# EAGLE design adaptador_mcp3002_fpga (EAGLE 7.7.0)
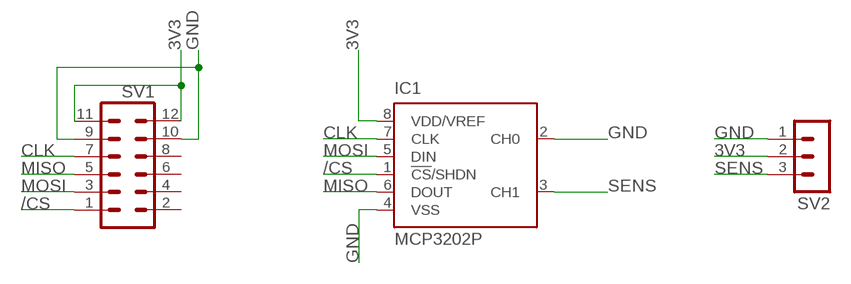
[diagram p0: schematic, sheet 1]

## Parts
IC1  MCP3202P  [DIL8]
SV1  MA06-2  [MA06-2]
SV2  MA03-1  [MA03-1]

## Nets
3V3: IC1.8(VDD/VREF) SV1.11 SV1.12 SV2.2
/CS: IC1.1(!CS!/SHDN) SV1.1
CLK: IC1.7(CLK) SV1.7
GND: IC1.2(CH0) IC1.4(VSS) SV1.9 SV1.10 SV2.1
MISO: IC1.6(DOUT) SV1.5
MOSI: IC1.5(DIN) SV1.3
SENS: IC1.3(CH1) SV2.3
Unconnected: SV1.2 SV1.4 SV1.6 SV1.8

## Library data of the parts
IC1 = microchip:MCP3202: 2.7V Dual Channel 12-Bit A/D Converter with SPI Serial Interface Source: http://ww1.microchip.com/downloads/en/DeviceDoc/21034D.pdf; MF: MICROCHIP; MPN: MCP3202-CI/P; OC_FARNELL: 1196794; OC_NEWARK: 72K7287
SV1 = con-lstb:MA06-2: PIN HEADER; OC_FARNELL: unknown; OC_NEWARK: unknown
SV2 = con-lstb:MA03-1: PIN HEADER; OC_FARNELL: unknown; OC_NEWARK: unknown

## Board
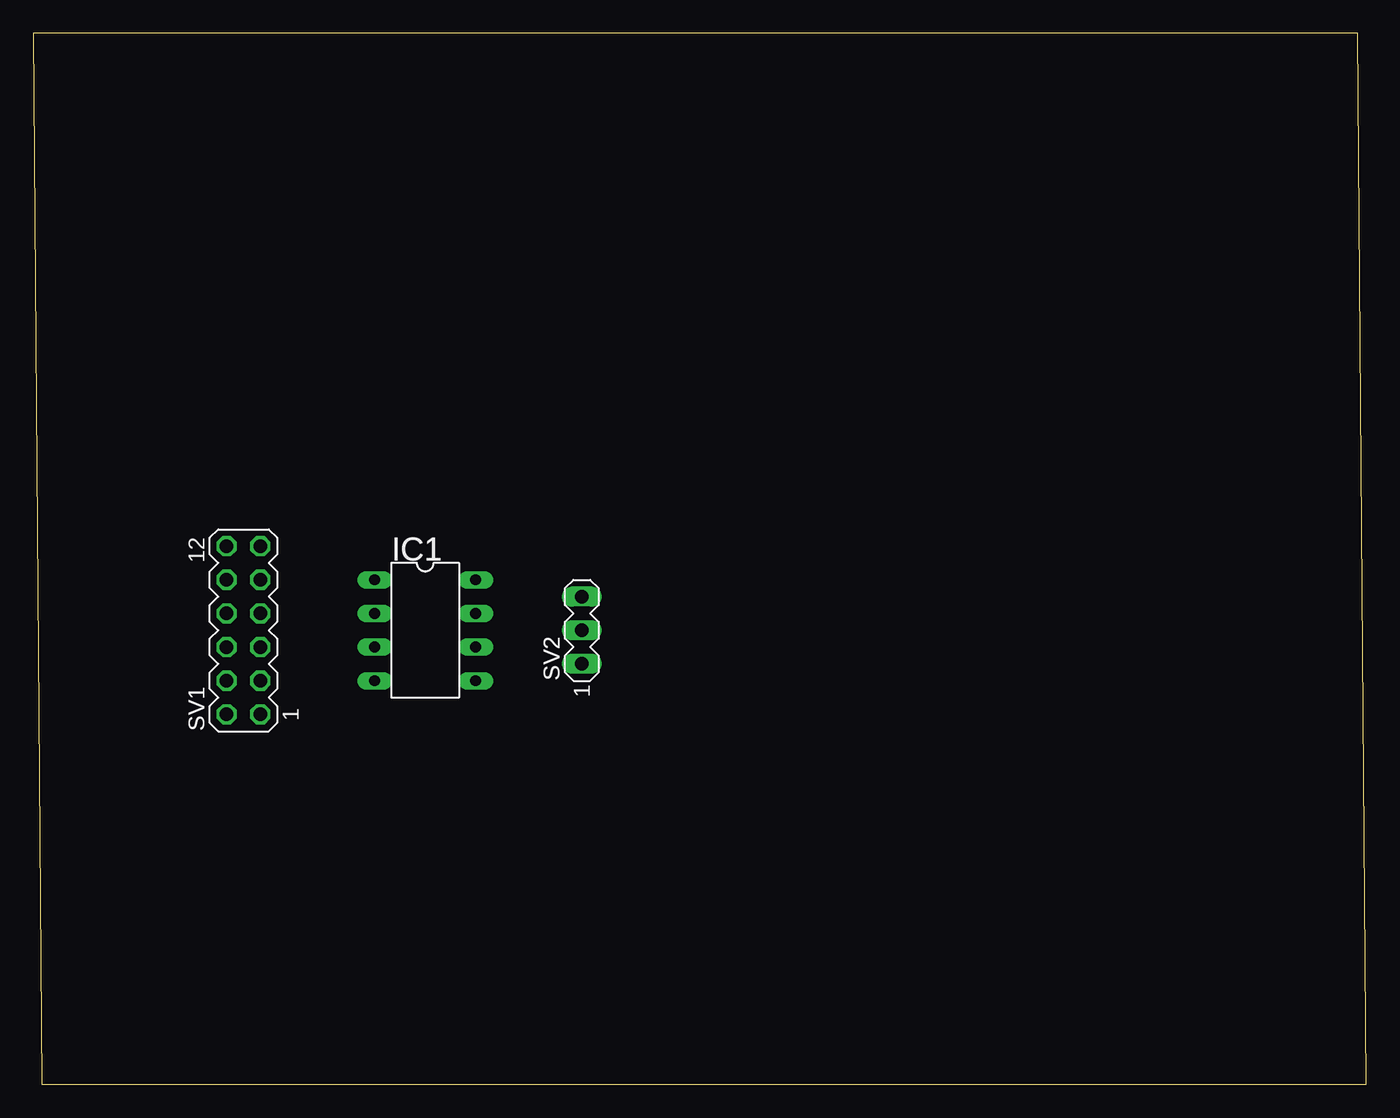
[diagram p1: board, top side]
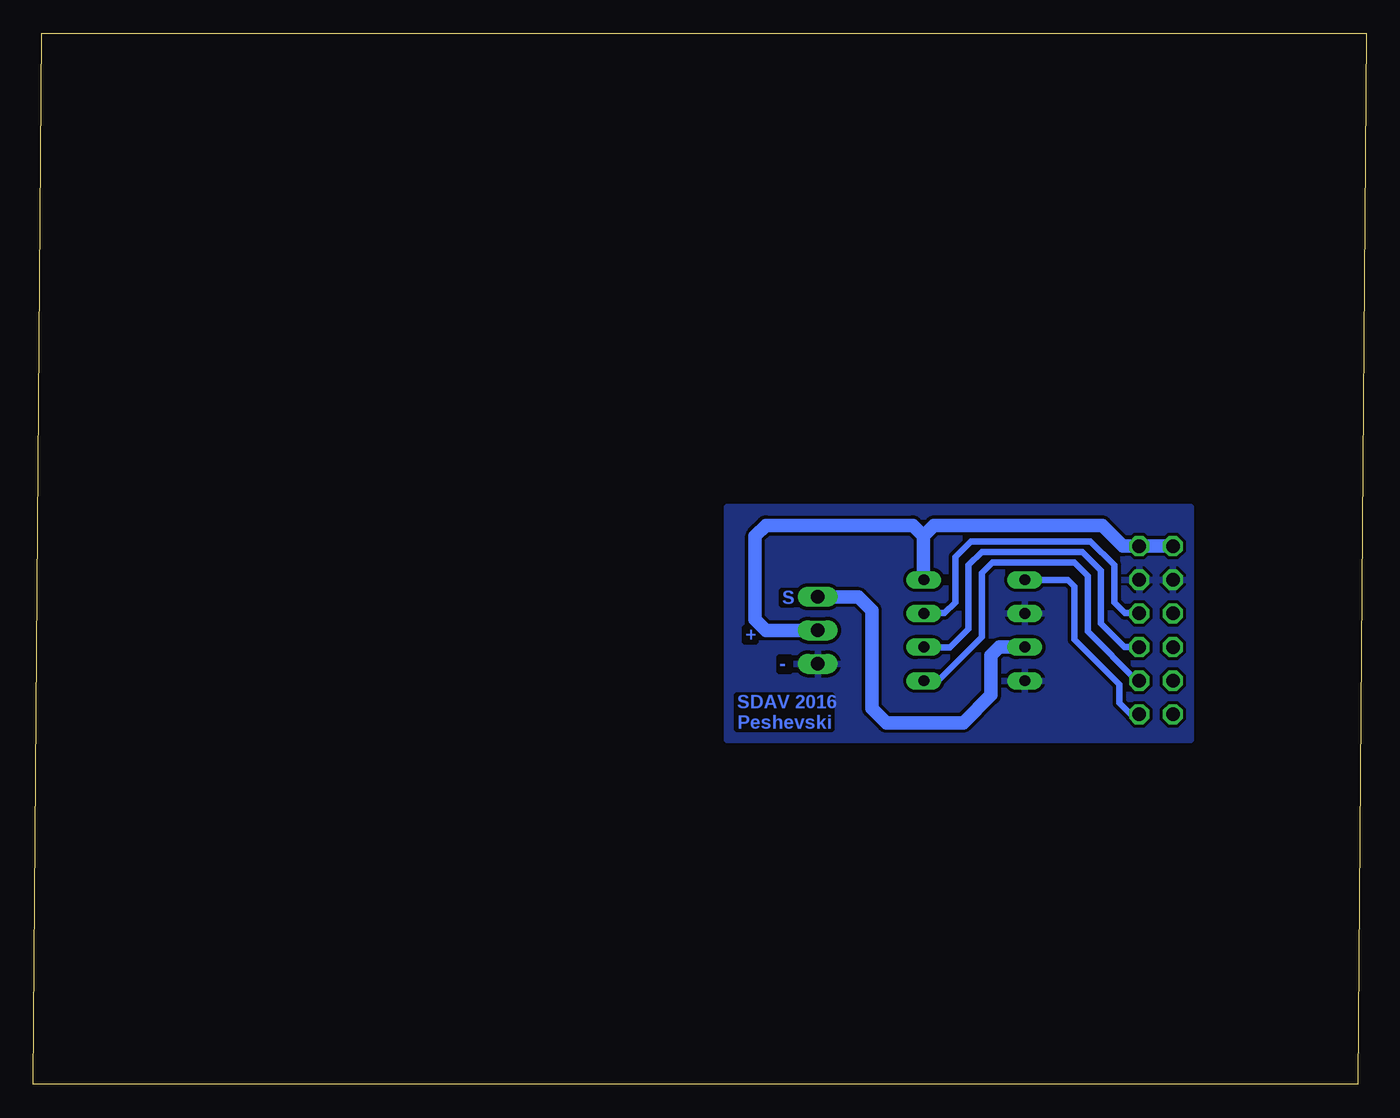
[diagram p2: board, bottom side, seen from below]

Size 100.64 x 79.36 mm. Coordinates in mm from the lower left corner, seen from the top.
Outline: 0.64,0 100.64,0 100,79.36 0,79.36 0.64,0
Copper layers (1*16): Top 0.035mm / dielectric 1.5mm / Bottom 0mil
Design rules "default *": minimum track width 10mil, minimum drill 24mil, track to track 8mil, track to pad 8mil, pad to pad 8mil, via to via 8mil, smd to smd 8mil, copper to edge 40mil, drill to drill 8mil, minimum pad ring 10mil, minimum via ring 8mil, stop-mask expansion 4mil, vias tented up to drill 0mil, thermal gap 10mil

### Footprints (pad centres in the part's own frame; a part is rotated, then mirrored left to right if it is on the bottom)
DIL8 = drill 0.813 long: 1 -3.81,-3.81; 2 -1.27,-3.81; 3 1.27,-3.81; 4 3.81,-3.81; 5 3.81,3.81; 6 1.27,3.81; 7 -1.27,3.81; 8 -3.81,3.81
MA06-2 = drill 1.016 octagon: 1 -6.35,-1.27; 2 -6.35,1.27; 3 -3.81,-1.27; 4 -3.81,1.27; 5 -1.27,-1.27; 6 -1.27,1.27; 7 1.27,-1.27; 8 1.27,1.27; 9 3.81,-1.27; 10 3.81,1.27; 11 6.35,-1.27; 12 6.35,1.27
MA03-1 = drill 1.016 long: 1 -2.54,0; 2 0,0; 3 2.54,0

### Placement (x,y rotation side)
IC1  29.6,34.29 270 top
SV1  15.88,34.29 90 top
SV2  41.41,34.29 90 top

### Tracks (layer width: path | path; a pad name or v marks a point on that pad's centre or on a via)
3V3
  Bottom 1: SV1.12 SV1.11 18.38,40.64 19.94,42.2 32.63,42.2 33.43,41.4 | 33.43,41.4 33.43,38.13 IC1.8 | 33.43,41.4 34.23,42.2 45.34,42.2 46.13,41.4 46.13,35.1 45.32,34.29 SV2.2
/CS
  Bottom 0.5: 17.18,27.94 SV1.1 17.78,27.94 18.64,28.8 18.64,30.2 22.04,33.6 22.04,37.6 22.54,38.1 IC1.1
CLK
  Bottom 0.5: SV1.7 17.19,35.6 18.24,35.6 19.04,36.4 19.04,39.2 20.84,41 29.84,41 31.04,39.8 31.04,36.4 31.84,35.6 33.36,35.6 IC1.7
GND
  pour Bottom (isolate 0.25): 13.27,43.58 48.27,43.58 48.27,26 13.27,26
MISO
  Bottom 0.5: SV1.5 18.26,33.02 20.04,34.8 20.04,38.8 21.44,40.2 29.04,40.2 30.04,39.2 30.04,34.4 31.44,33 33.38,33 IC1.6
MOSI
  Bottom 0.5: SV1.3 17.32,30.48 21.04,34.2 21.04,38.4 22.04,39.4 28.24,39.4 29.04,38.6 29.04,33.8 32.44,30.4 33.32,30.4 IC1.5
SENS
  Bottom 1: IC1.3 27.71,33.02 28.34,32.4 28.34,29.4 30.44,27.3 36.23,27.3 37.34,28.4 37.34,35.8 38.34,36.8 41.38,36.8 SV2.3

### Text on the board
Bottom: S | + | - | SDAV 2016 / Peshevski
_tNames: IC1 | SV2 | SV1